# Altium schematic sheet BMS Interface.SchDoc
size A4; Organization: TESLA Motors, INC; Address1: 3500 Deer Creek Road; Address2: Palo Alto, CA; Address4: U.S.A.; SheetNumber: 11; SheetTotal: 11
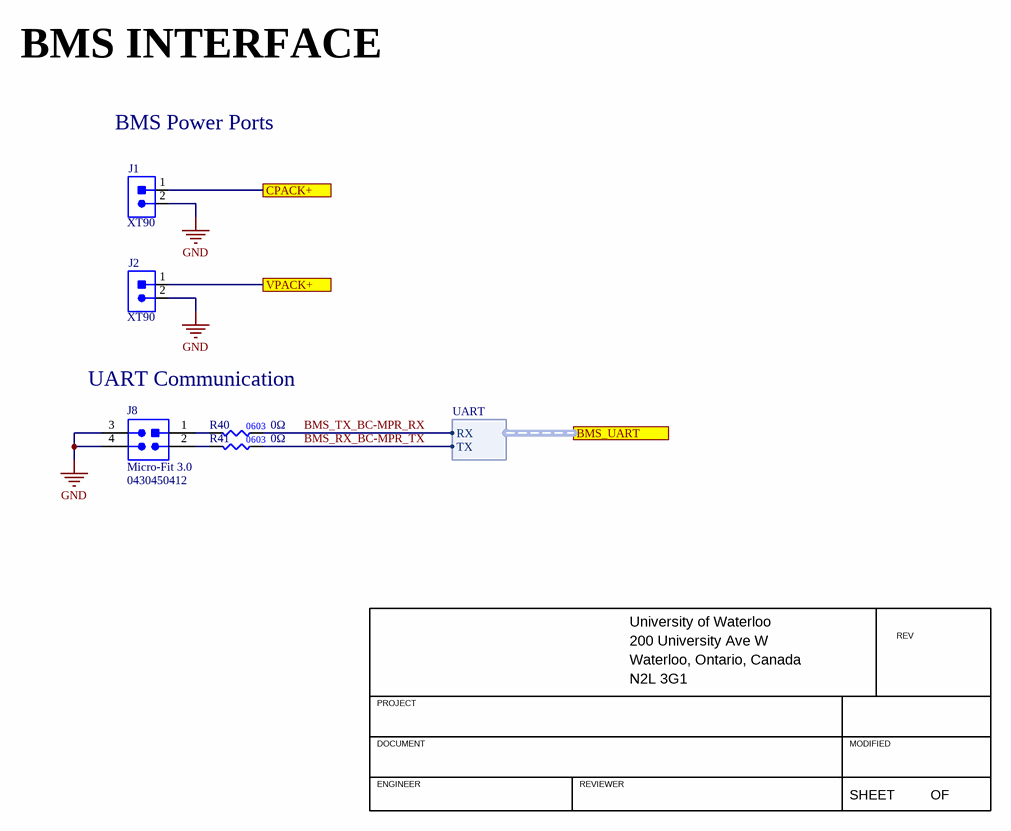
[diagram p0: BMS Interface.SchDoc]

## Parts
J1  CON_2POS_XT90  [XT90]  (value not drawn)
J2  CON_2POS_XT90  [XT90]  (value not drawn)
J8  Family: Micro-Fit 3.0  [MOLEX-0430450412]  (hidden comment: 0430450412)
R40  value 0Ω  [RES0603]  (hidden comment: RES_0Ω_0603)
R41  value 0Ω  [RES0603]  (hidden comment: RES_0Ω_0603)

## Ports
BMS_UART (harness UART), CPACK+, VPACK+

## Harnesses
UART: TX, RX

## Nets
GND: J1.2 J2.2 J8.3 J8.4
BMS_RX_BC-MPR_TX: R41.2 ; port BMS_UART.TX
BMS_TX_BC-MPR_RX: R40.2 ; port BMS_UART.RX
CPACK+: J1.1 ; port CPACK+
VPACK+: J2.1 ; port VPACK+
NetJ8_1: J8.1 R40.1
NetJ8_2: J8.2 R41.1

## Notes on the sheet
- BMS INTERFACE
- BMS Power Ports
- UART Communication
- University of Waterloo
- 200 University Ave W
- REV
- PROJECT
- Waterloo, Ontario, Canada
- N2L 3G1
- DOCUMENT
- ENGINEER
- REVIEWER
- MODIFIED
- SHEET
- OF

## Library data of the parts
J1 J2 = CON_2POS_XT90: HIGH QUALITY GOLD PLATED XT90 MA; Manufacturer 1: DFRobot; Manufacturer Part Number 1: FIT0588; Mounting Type: TH; Package/Footprint: XT90; Supplier 1: Digi-Key; Supplier Part Number 1: 1738-1438-ND
J8 = CON_MOLEX-HDR_2x2_TH: CONN HEADER VERT 4POS 3MM; Manufacturer 1: Molex; Voltage Rating: 600V; Current Rating: 8A; Pitch: 3mm; Supplier 1: Digi-Key; Supplier Part Number 1: WM1790-ND; Manufacturer Part Number 1: 0430450412
R40 R41 = RES_0Ω_0603: RES 0 OHM JUMPER 1/10W 0603; Manufacturer 1: Yageo; Manufacturer Part Number 1: RC0603JR-070RL; Supplier Part Number 1: 311-0.0GRCT-ND; Supplier 1: Digi-Key; Mounting Type: SMD; Package: 0603